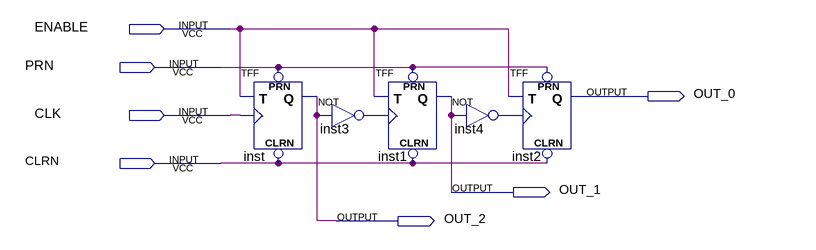
[diagram p0: schematic sheet]
// Quartus schematic counter.bdf as structural Verilog: 5 symbols, 7 pins
module counter (
  input  ENABLE,
  input  PRN,
  input  CLK,
  input  CLRN,
  output OUT_0,
  output OUT_1,
  output OUT_2
);

  wire inst3_out, inst4_out;

  TFF inst (.PRN(PRN), .CLRN(CLRN), .T(ENABLE), .CLK(CLK), .Q(OUT_2));
  not inst3 (inst3_out, OUT_2);
  TFF inst1 (.PRN(PRN), .CLRN(CLRN), .T(ENABLE), .CLK(inst3_out), .Q(OUT_1));
  TFF inst2 (.PRN(PRN), .CLRN(CLRN), .T(ENABLE), .CLK(inst4_out), .Q(OUT_0));
  not inst4 (inst4_out, OUT_1);
endmodule
